# Altium schematic sheet 08-RF_GPS.SchDoc
size C; SheetNumber: 8; SheetTotal: 12; SPICEModelCacheLBXRMXYW: <root> / <DocumentId>LBXRMXYW</DocumentId> / <CacheFrame Number="0"> / <Model Name="umk105bj104_v-f" Kind="CKT"> / <Text>* UMK105BJ104_V-F     SPICE MODEL  ( General Type ) / *-------------------------------------------------------------------------------------------------------- / * Model Generated by TAIYO YUDEN Corporation (http://www.ty-top.com) / * Version 1.0 / * TAIYO YUDEN Control No. 170508_120810 / * Copyright(c) 2012 TAIYO YUDEN CO.,LTD. All Rights Reserved. / *-------------------------------------------------------------------------------------------------------- / * / * Products Name : Multilayer Ceramic Capacitors / * / * Characteristics : / *     Capacitance : 0.1 uF , Rated Voltage : 50V , TCC : X5R / *     Case Size : 1.0 x 0.5 / 0.039 x 0.02 [mm/inch] , Thickness : 0.5 / 0.02 [mm/inch] / *     (Conditions: Temperature = 25 degC , DC Bias Current/Voltage = 0A / 0V) / * / * Frequency Range : 40Hz - 3GHz / * / * External Node Assignments : / * / *  1  o---| |---o  2 / * / *-------------------------------------------------------------------------------------------------------- / .SubCkt UMK105BJ104_V-F 1 2 / **************************** / C0 1 110 0.068998u / Cm 1 101 0.01292u / C1 101 102 0.041907u / Rc1 101 102 25.432k / C2 102 103 0.021417u / Rc2 102 103 1.1926k / C3 103 110 0.016759u / Rc3 103 110 12.415 / C2m 1 301 0.022631u / C21 301 302 0.1608u / Rc21 301 302 202.11k / C22 302 303 0.054305u / Rc22 302 303 87.274k / C23 303 304 0.14296u / Rc23 303 304 7.7387k / C24 304 305 0.08092u / Rc24 304 305 2.9339k / C25 305 306 0.04951u / Rc25 305 306 2.1733k / C26 306 307 0.043691u / Rc26 306 307 191.91 / C27 307 308 0.016759u / Rc27 307 308 147.23 / C28 308 309 5027.4p / Rc28 308 309 97.746 / C29 309 110 570.66p / Rc29 309 110 12.365 / Rp0 1 110 5G / L0 110 120 0.23341n / Lm 120 130 0.14222n / L1 120 121 0.036554n / RL1 121 130 1.698 / L2 120 122 0.11188n / RL2 122 130 0.33926 / L3 120 123 1.1401n / RL3 123 130 1.655 / CR 120 124 0.028892u / LR 124 125 0.10347n / RR 125 130 0.14446 / CL 130 140 2.048p / LL 130 140 0.1545n / RL 130 140 189.66 / Rs 140 2 26.069m / **************************** / .ends UMK105BJ104_V-F</Text> / </Model> / </CacheFrame> / </root>
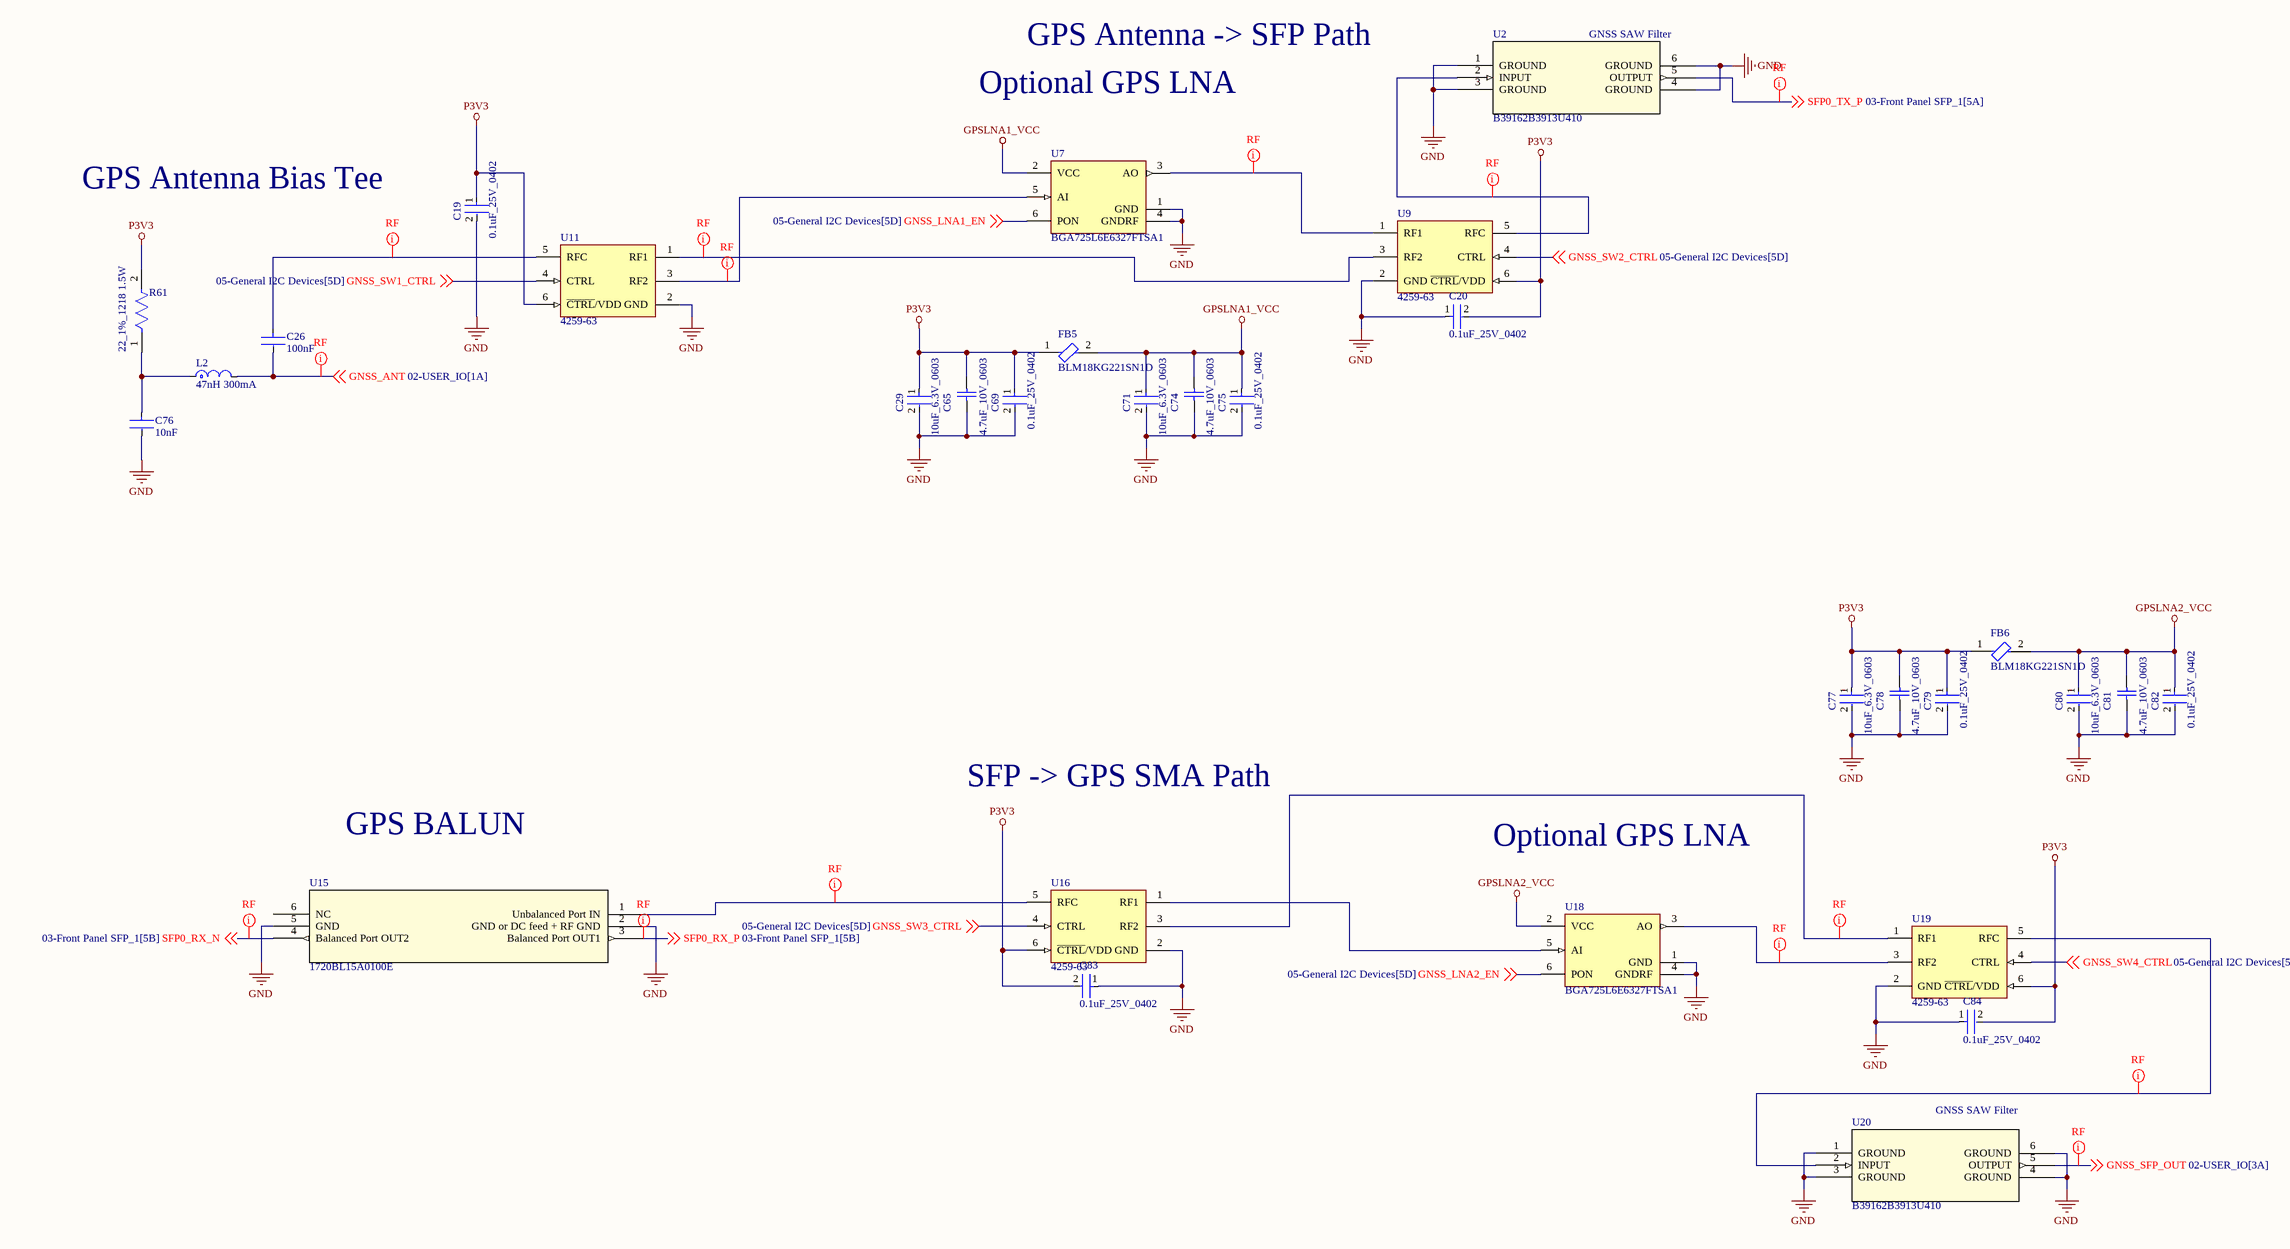
[diagram p0: 08-RF_GPS.SchDoc]

## Parts
C19  0.1uF_25V_0402  [FP-0402-L_1_0_1-W_0_5_0_1-IPC_C]
C20  0.1uF_25V_0402  [FP-0402-L_1_0_1-W_0_5_0_1-IPC_C]
C26  100nF  [FP-0402-L_1_0_0_05-W_0_5-IPC_B]
C29  10uF_6.3V_0603  [FP-C0603C106M9PACTU-MFG]
C65  4.7uF_10V_0603  [CAPC1608X87X35NL15T15]
C69  0.1uF_25V_0402  [FP-0402-L_1_0_1-W_0_5_0_1-IPC_C]
C71  10uF_6.3V_0603  [FP-C0603C106M9PACTU-MFG]
C74  4.7uF_10V_0603  [CAPC1608X87X35NL15T15]
C75  0.1uF_25V_0402  [FP-0402-L_1_0_1-W_0_5_0_1-IPC_C]
C76  10nF  [FP-GRM033-0_03-IPC_B]
C77  10uF_6.3V_0603  [FP-C0603C106M9PACTU-MFG]
C78  4.7uF_10V_0603  [CAPC1608X87X35NL15T15]
C79  0.1uF_25V_0402  [FP-0402-L_1_0_1-W_0_5_0_1-IPC_C]
C80  10uF_6.3V_0603  [FP-C0603C106M9PACTU-MFG]
C81  4.7uF_10V_0603  [CAPC1608X87X35NL15T15]
C82  0.1uF_25V_0402  [FP-0402-L_1_0_1-W_0_5_0_1-IPC_C]
C83  0.1uF_25V_0402  [FP-0402-L_1_0_1-W_0_5_0_1-IPC_C]
C84  0.1uF_25V_0402  [FP-0402-L_1_0_1-W_0_5_0_1-IPC_C]
FB5  BLM18KG221SN1D  [FP-BLM18-0_15-t0_8-IPC_B]
FB6  BLM18KG221SN1D  [FP-BLM18-0_15-t0_8-IPC_B]
L2  47nH 300mA  [FP-LQG15HH_02-IPC_B]
R61  22_1%_1218 1.5W  [FP-CRCW1218-HPe3-MFG]
U2  B39162B3913U410  [B39162B3913U410_QUA]
U7  BGA725L6E6327FTSA1  [FP-PG-TSLP-6-MFG]
U9  4259-63  [PERE-SC-70-6_M]
U11  4259-63  [PERE-SC-70-6_M]
U15  1720BL15A0100E  [SMT_15B0050E_JOT]
U16  4259-63  [PERE-SC-70-6_M]
U18  BGA725L6E6327FTSA1  [FP-PG-TSLP-6-MFG]
U19  4259-63  [PERE-SC-70-6_M]
U20  B39162B3913U410  [B39162B3913U410_QUA]

## Nets
GND: C19.2 C20.1 C29.2 C65.1 C69.2 C71.2 C74.1 C75.2 C76.2 C77.2 C78.1 C79.2 C80.2 C81.1 C82.2 C83.1 C84.1 U2.1(GROUND) U2.3(GROUND) U2.4(GROUND) U2.6(GROUND) U7.1(GND) U7.4(GNDRF) U9.2(GND) U11.2(GND) U15.2(GND_or_DC_feed_+_RF_GND) U15.5(GND) U16.2(GND) U18.1(GND) U18.4(GNDRF) U19.2(GND) U20.1(GROUND) U20.3(GROUND) U20.4(GROUND) U20.6(GROUND)
GPSLNA1_VCC: C71.1 C74.2 C75.1 FB5.2 U7.2(VCC)
GPSLNA2_VCC: C80.1 C81.2 C82.1 FB6.2 U18.2(VCC)
P3V3: C19.1 C20.2 C29.1 C65.2 C69.1 C77.1 C78.2 C79.1 C83.2 C84.2 FB5.1 FB6.1 R61.2 U9.6(~{CTRL}/VDD) U11.6(~{CTRL}/VDD) U16.6(~{CTRL}/VDD) U19.6(~{CTRL}/VDD)
GNSS_ANT: C26.2 L2.2 ; off-sheet GNSS_ANT
GNSS_LNA1_EN: U7.6(PON) ; off-sheet GNSS_LNA1_EN
GNSS_LNA2_EN: U18.6(PON) ; off-sheet GNSS_LNA2_EN
GNSS_SFP_OUT: U20.5(OUTPUT) ; off-sheet GNSS_SFP_OUT
GNSS_SW1_CTRL: U11.4(CTRL) ; off-sheet GNSS_SW1_CTRL
GNSS_SW2_CTRL: U9.4(CTRL) ; off-sheet GNSS_SW2_CTRL
GNSS_SW3_CTRL: U16.4(CTRL) ; off-sheet GNSS_SW3_CTRL
GNSS_SW4_CTRL: U19.4(CTRL) ; off-sheet GNSS_SW4_CTRL
SFP0_RX_N: U15.4(Balanced_Port_OUT2) ; off-sheet SFP0_RX_N
SFP0_RX_P: U15.3(Balanced_Port_OUT1) ; off-sheet SFP0_RX_P
SFP0_TX_P: U2.5(OUTPUT) ; off-sheet SFP0_TX_P
NetC26_1: C26.1 U11.5(RFC)
NetC76_1: C76.1 L2.1 R61.1
NetU2_2: U2.2(INPUT) U9.5(RFC)
NetU7_3: U7.3(AO) U9.1(RF1)
NetU7_5: U7.5(AI) U11.3(RF2)
NetU9_3: U9.3(RF2) U11.1(RF1)
NetU15_1: U15.1(Unbalanced_Port_IN) U16.5(RFC)
NetU16_1: U16.1(RF1) U18.5(AI)
NetU16_3: U16.3(RF2) U19.1(RF1)
NetU18_3: U18.3(AO) U19.3(RF2)
NetU19_5: U19.5(RFC) U20.2(INPUT)

Not connected (* = marked no-connect by the designer): U15 6(NC)

## Layout directives
net class RF: GNSS_ANT, GNSS_SFP_OUT, NetC26_1, NetU2_2, NetU7_3, NetU7_5, NetU9_3, NetU15_1, NetU16_3, NetU18_3, NetU19_5, SFP0_RX_N, SFP0_RX_P, SFP0_TX_P

## Notes on the sheet
- GPS Antenna -> SFP Path
- (near U2) GNSS SAW Filter
- Optional GPS LNA
- GPS Antenna Bias Tee
- GPS BALUN
- SFP -> GPS SMA Path
- (near U20) GNSS SAW Filter

## Library data of the parts
C19 C20 C69 C75 C79 C82-C84 = CMP-2008-02519-2: General Purpose Ceramic Capacitor, 0402, 100nF, 10%, X7R, 15%, 25V; Package Quantity: 1; Capacitance: 100nF; Min Operating Temperature: -55°C; Voltage: 25V; Voltage Rating: 25V; Construction: Flat; Max Operating Temperature: 125°C; Radiation Hardening: No; Depth: 0.5mm; Thickness: 0.022inch; Voltage Rating (DC): 25V; Number of Pins: 2; Lead Free: Lead Free; Series: -; REACH SVHC: No SVHC; Length: 1mm; Dielectric: X7R; RoHS Compliant: Yes; Mount: Surface Mount; Packaging: Tape and Reel; Case/Package: 0402; Case Code (Imperial): 0402; Termination: SMD/SMT; Width: 0.02inch; Case Code (Metric): 1005; Tolerance: 10%
C26 = CMP-14477-000330-2: None; Voltage Rating (DC): 50V; Dielectric: X5R; Tolerance: 10%; RoHS Compliant: Yes; Termination: SMD/SMT; Packaging: Tape and Reel; Capacitance: 100nF; Height: 0.5mm; Halogen Free: Halogen Free; Case Code (Metric): 1005; Width: 0.02inch; Max Operating Temperature: 85°C; Voltage Rating: 50V; Min Operating Temperature: -55°C; Package Quantity: 10000; Case/Package: 0402; Case Code (Imperial): 0402; Length: 0.039inch; Thickness: 0.022inch; Mount: Surface Mount
C29 C71 C77 C80 = CMP-2006-02285-3: CAP CER 10UF 6.3V X5R 0603; Manufacturer Part Number: C0603C106M9PACTU; Manufacturer: Kemet; Material: Ceramic; Temperature Coefficient: 15%; Tolerance: 20%; Category: Cap; Height: 0.9mm; Digikey Description: CAP CER 10UF 6.3V X5R 0603; Mouser Description: In a Pack of 10, KEMET 0603 (1608M) 10µF MLCC 6.3V dc ±20% SMD C0603C106M9PACTU; Voltage Rating: 6.3V; Device Class L2: Capacitors; Temperature Range Low: -55°C; Temperature Characteristic: X5R; ComponentLink2Description: Datasheet; Ipc Land Pattern Name: CAPC16080X80; ComponentLink2URL: http://www.kemet.com/Lists/ProductCatalog/Attachments/19/KEM_C1006_X5R_SMD.pdf; Capacitance: 10uF; Temperature Range High: +85°C; Device Class L3: Ceramic Capacitors; RoHS: TRUE; Automotive: No; Value: 10uF; Temperature: -55°C to +85°C; Device Class L1: Passive Components; Package: C0603C106M9PACTU; Lead Free: Yes; Octopart: https://octopart.com/c0603c106m9pactu-kemet-8375727
C65 C74 C78 C81 = CMP-2006-03238-1: Part Number: C0603C475K8PACTU; Manufacturer: Kemet
C76 = CMP-06035-000448-1: Chip Multilayer Ceramic Capacitors for General Purpose, 0201, 10000pF, X7R, 15%, 10%, 16V; Width: 300um; Tolerance: 10%; Capacitance: 10nF; Thickness: 300um; Dielectric: X7R; Voltage Rating (DC): 16V; Length: 600um
FB5 FB6 = CMP-0686-00556-7: Chip Ferrite Bead, 0603, 220Ω @ 100MHz, 0.05Ω, 25%, 2.2A; DC Resistance (DCR): 50mR; Number of Circuits: 1; Impedance: 220R; Current Rating: 2.2A; Material: Ferrite; Test Frequency: 100MHz; Depth: 0.8mm; Series: BLM18K; RoHS Compliant: Yes; Termination: SMD/SMT; Max Current Rating: 2.2A; Case Code (Metric): 1608; Radiation Hardening: No; Number of Pins: 2; Length: 1.6mm; Lead Free: Lead Free; Package Quantity: 1; Height: 0.8mm; Core Material: Ferrite; Inductor Type: FERRITE BEAD; Min Operating Temperature: -55°C; Case/Package: 0603; Case Code (Imperial): 0603; Number of Lines: 1; Packaging: Tape and Reel; REACH SVHC: No SVHC; Max Operating Temperature: 125°C; Military Standard: Not; DC Resistance-Max: 50mR; Width: 0.8mm; DC Current: 2.2A; Max DC Current: 2.2A; Tolerance: 25%; Weight: 7.1E-05oz
L2 = CMP-06042-015783-1: Multilayer type RF Inductor 47nH ±5% 0.72Ω 300mA 0402; Core Material: Air; DC Resistance (DCR): 720mR; DC Current: 200mA; Shielding: Unshielded; Self Resonant Frequency: 1GHz; Q Factor: 8; Test Frequency: 100MHz; Tolerance: 5%; Packaging: Tape and Reel; Case Code (Imperial): 0402; Max Operating Temperature: 125°C; Military Standard: Not; Length: 1mm; Radiation Hardening: No; Height: 0.5mm; Min Operating Temperature: -55°C; Width: 0.02inch; Inductance: 47nH; Lead Free: Lead Free; Termination: SMD/SMT; Height - Seated (Max): 0.022inch; Rated Current-Max: 200mA; Case/Package: 0402; Max DC Current: 200mA; Series: LQG15HS; Case Code (Metric): 1005; Mount: Surface Mount; Current Rating: 200mA; Depth: 0.55mm; Package Quantity: 1
R61 = CMP-02407-011337-1: RES Thick Film, 22.6Ω, 1%, 1.5W, 100ppm/°C, 1218; Resistance: 22.6R; Temperature Coefficient: 100ppm/°C; Min Operating Temperature: -55°C; Number of Terminations: 2; Length: 0.122inch; Max Operating Temperature: 155°C; Packaging: Tape and Reel; Case/Package: 1218; Height: 0.028inch; RoHS Compliant: Yes; Tolerance: 1%; Width: 0.181inch; Package Quantity: 4000; Resistor Type: Thick Film; Features: Automotive AEC-Q200; Lead Free: Lead Free; Max Power Dissipation: 1.5W
U2 U20 = B39162B3913U410: No Description Available; Mfr_Name: Qualcomm; RefDes: RefDes; Type: Type
U7 U18 = CMP-32860-000003-1: IC AMP GPS 1.55-1.615GHZ TSLP6-2; Manufacturer: Infineon; Max Power Dissipation: 72mW; Noise Figure: 0.65dB; Gain: 20dB; Max Junction Temp: +150°C; Nominal Supply Current: 3.6mA; Max Supply Voltage: 3.6V; Min Supply Voltage: 1.5V; Max Frequency: 1615MHz; Bandwidth: 65MHz; RoHS: TRUE; Device Class L1: Integrated Circuits (ICs); Manufacturer Part Number: BGA725L6E6327FTSA1; Octopart: https://octopart.com/bga725l6e6327ftsa1-infineon-23421878; Temperature Range High: +150°C; Temperature: to +150°C; ComponentLink2URL: https://www.infineon.com/dgdl/Infineon-BGA725L6-DS-v02_00-en.pdf?fileId=db3a30433784a0400137ef9a4d341f23; Device Class L2: RF Semiconductors and Devices; Ambient Temperature Range Low: -40°C; Device Class L3: RF Amplifiers; ComponentLink2Description: Datasheet; Mouser Description: RF Amp Chip Single Low Noise Amplifier 1615MHz 3.6V 6-Pin TSLP T/R; Digikey Description: IC AMP GPS 1.55-1.615GHZ TSLP6-2; Package: PG-TSLP-6; Ambient Temperature Range High: +85°C; Footprint Url: https://www.infineon.com/cms/en/product/packages/PG-TSLP/PG-TSLP-6-2/; Category: IC; Lead Free: Yes; Height: 0.4mm; Automotive: No
U9 U11 U16 U19 = CMP-2000-05298-1: IC RF Switch SPDT, 50 Ohm, 6-Pin SC70, RoHS, Tape and Reel; Manufacturer: Peregrine Semiconductor; P1dB: 29dBm(typ)IP1dB; Topology: Reflective; Frequency - Upper: 3GHz; Insertion Loss @ Frequency: 0.5dB@2GHz; IIP3: 55dBm(typ); Voltage - Supply: 1.8V~3.3V; Other Names: 1046-1011-24259-63-ND425963PE4259PE4259SCBC-ZPE4259SCBC-Z-ND; Isolation @ Frequency: 20dB@2GHz(typ); Frequency - Lower: 10MHz; Online Catalog: PE4259; Impedance: 50Ohm; RF Type: GeneralPurpose; Series: UltraCMOS; Manufacturer URL: http://www.psemi.com/; Package Description: 6-Pin Small Outline Transistor, Body 2.05 x 1.25 mm, Pitch 0.65 mm; Family: RFSwitches; Packaging: Tape&Reel(TR); Features: Single/DualLineControl; Package / Case: 6-TSSOP,SC-88,SOT-363; Operating Temperature: -40degC~85degC; Circuit: SPDT; Supplier Device Package: SC-70-6; Standard Package: 3,000; Datasheet URL: https://datasheet.ciiva.com/15100/getdatasheetpartid-685660-15100501.pdf; Category: RF/IFandRFID; Datasheet Version: Jan-11; Package Reference: SC-70-6
U15 = 1720BL15A0100E: No Description Available; Mfr_Name: Johanson Technology; RefDes: RefDes; Type: Type